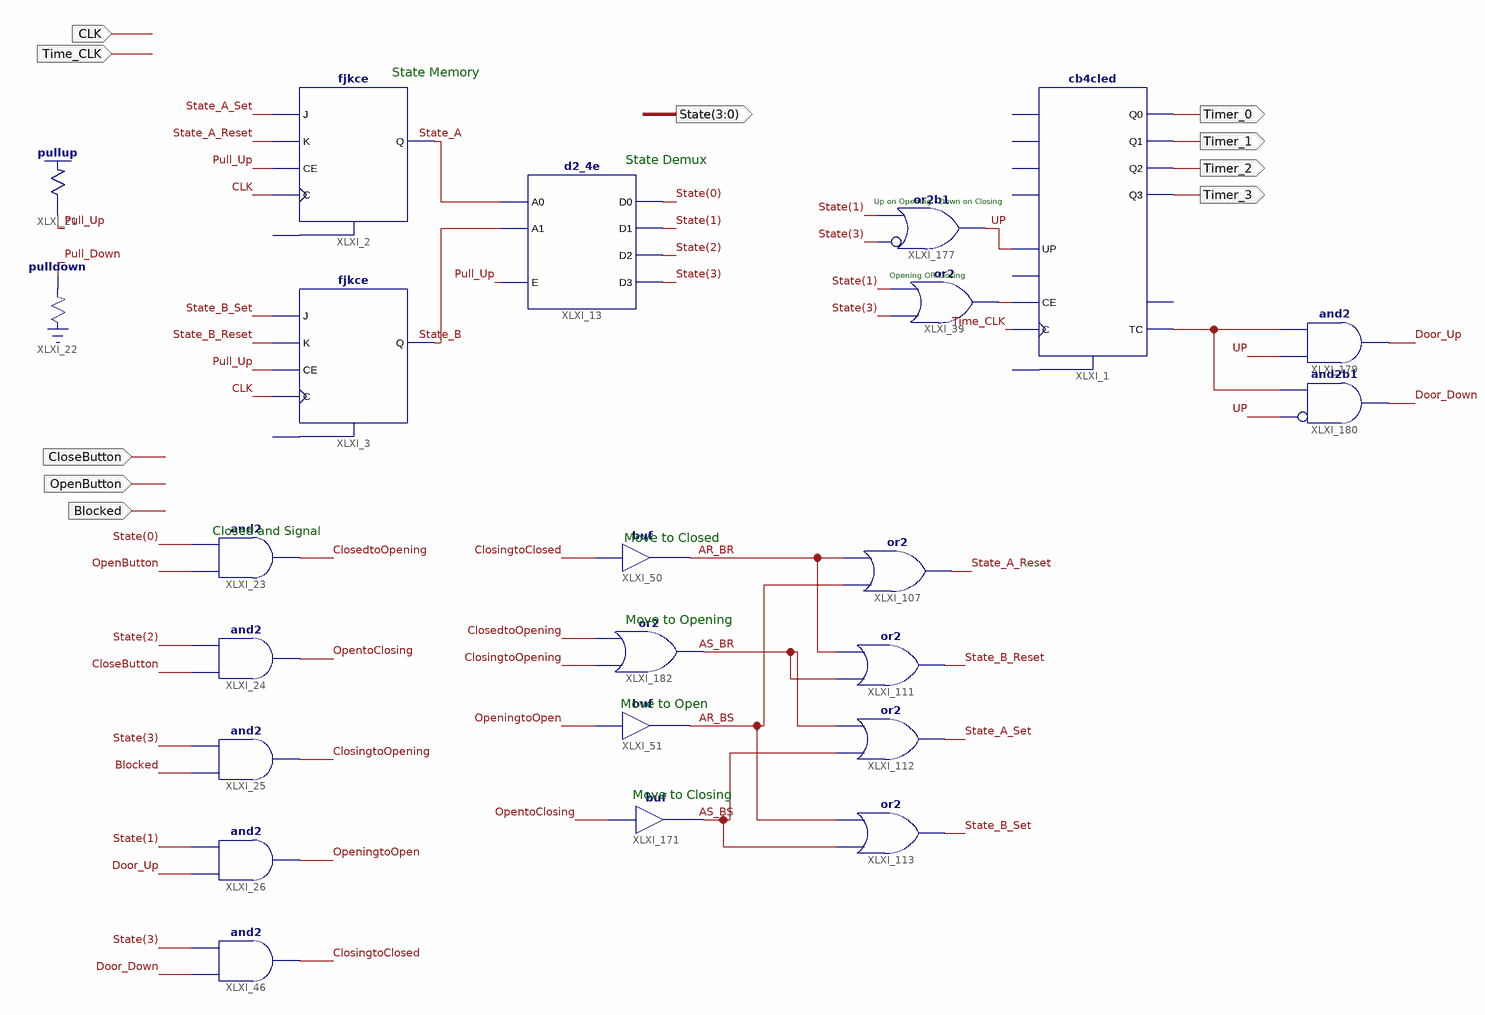
[diagram p0: schematic sheet 1]
// Xilinx ISE schematic Exp2.sch (spartan3e) as structural Verilog: 23 symbols, 10 ports
module Exp2 (
  input  Time_CLK,
  input  CLK,
  input  Blocked,
  input  OpenButton,
  input  CloseButton,
  output Timer_0,
  output [3:0] State,
  output Timer_1,
  output Timer_2,
  output Timer_3
);

  wire AR_BR, AR_BS, AS_BR, AS_BS, ClosedtoOpening, ClosingtoClosed, ClosingtoOpening, Door_Down, Door_Up,
       OpeningtoOpen, OpentoClosing, Pull_Down, Pull_Up, State_A, State_A_Reset, State_A_Set, State_B,
       State_B_Reset, State_B_Set, UP, XLXN_100, XLXN_254;

  fjkce XLXI_2 (.C(CLK), .CE(Pull_Up), .J(State_A_Set), .K(State_A_Reset), .Q(State_A));  // open: CLR
  fjkce XLXI_3 (.C(CLK), .CE(Pull_Up), .J(State_B_Set), .K(State_B_Reset), .Q(State_B));  // open: CLR
  cb4cled XLXI_1 (
    .C(Time_CLK), .CE(XLXN_100), .UP(UP), .Q0(Timer_0), .Q1(Timer_1), .Q2(Timer_2), .Q3(Timer_3),
    .TC(XLXN_254));  // open: CLR, D0, D1, D2, D3, L, CEO
  or XLXI_39 (XLXN_100, State[3], State[1]);
  \pullup  XLXI_21 (.O(Pull_Up));
  \pulldown  XLXI_22 (.O(Pull_Down));
  d2_4e XLXI_13 (.A0(State_A), .A1(State_B), .E(Pull_Up), .D0(State[0]), .D1(State[1]), .D2(State[2]), .D3(State[3]));
  and XLXI_23 (ClosedtoOpening, OpenButton, State[0]);
  and XLXI_24 (OpentoClosing, CloseButton, State[2]);
  and XLXI_25 (ClosingtoOpening, Blocked, State[3]);
  and XLXI_26 (OpeningtoOpen, Door_Up, State[1]);
  buf XLXI_50 (AR_BR, ClosingtoClosed);
  buf XLXI_51 (AR_BS, OpeningtoOpen);
  or XLXI_107 (State_A_Reset, AR_BS, AR_BR);
  or XLXI_111 (State_B_Reset, AS_BR, AR_BR);
  or XLXI_112 (State_A_Set, AS_BS, AS_BR);
  or XLXI_113 (State_B_Set, AS_BS, AR_BS);
  and XLXI_46 (ClosingtoClosed, Door_Down, State[3]);
  buf XLXI_171 (AS_BS, OpentoClosing);
  or XLXI_177 (UP, ~State[3], State[1]);  // or2b1
  and XLXI_179 (Door_Up, UP, XLXN_254);
  and XLXI_180 (Door_Down, ~UP, XLXN_254);  // and2b1
  or XLXI_182 (AS_BR, ClosingtoOpening, ClosedtoOpening);

  // Notes on the sheet:
  //   State Memory
  //   State Demux
  //   Up on Opening - Down on Closing
  //   Opening OR Closing
  //   Closed and Signal
  //   Move to Closed
  //   Move to Opening
  //   Move to Open
  //   Move to Closing
endmodule
